# EAGLE design exciting_voltage2 (EAGLE 6.5.0)
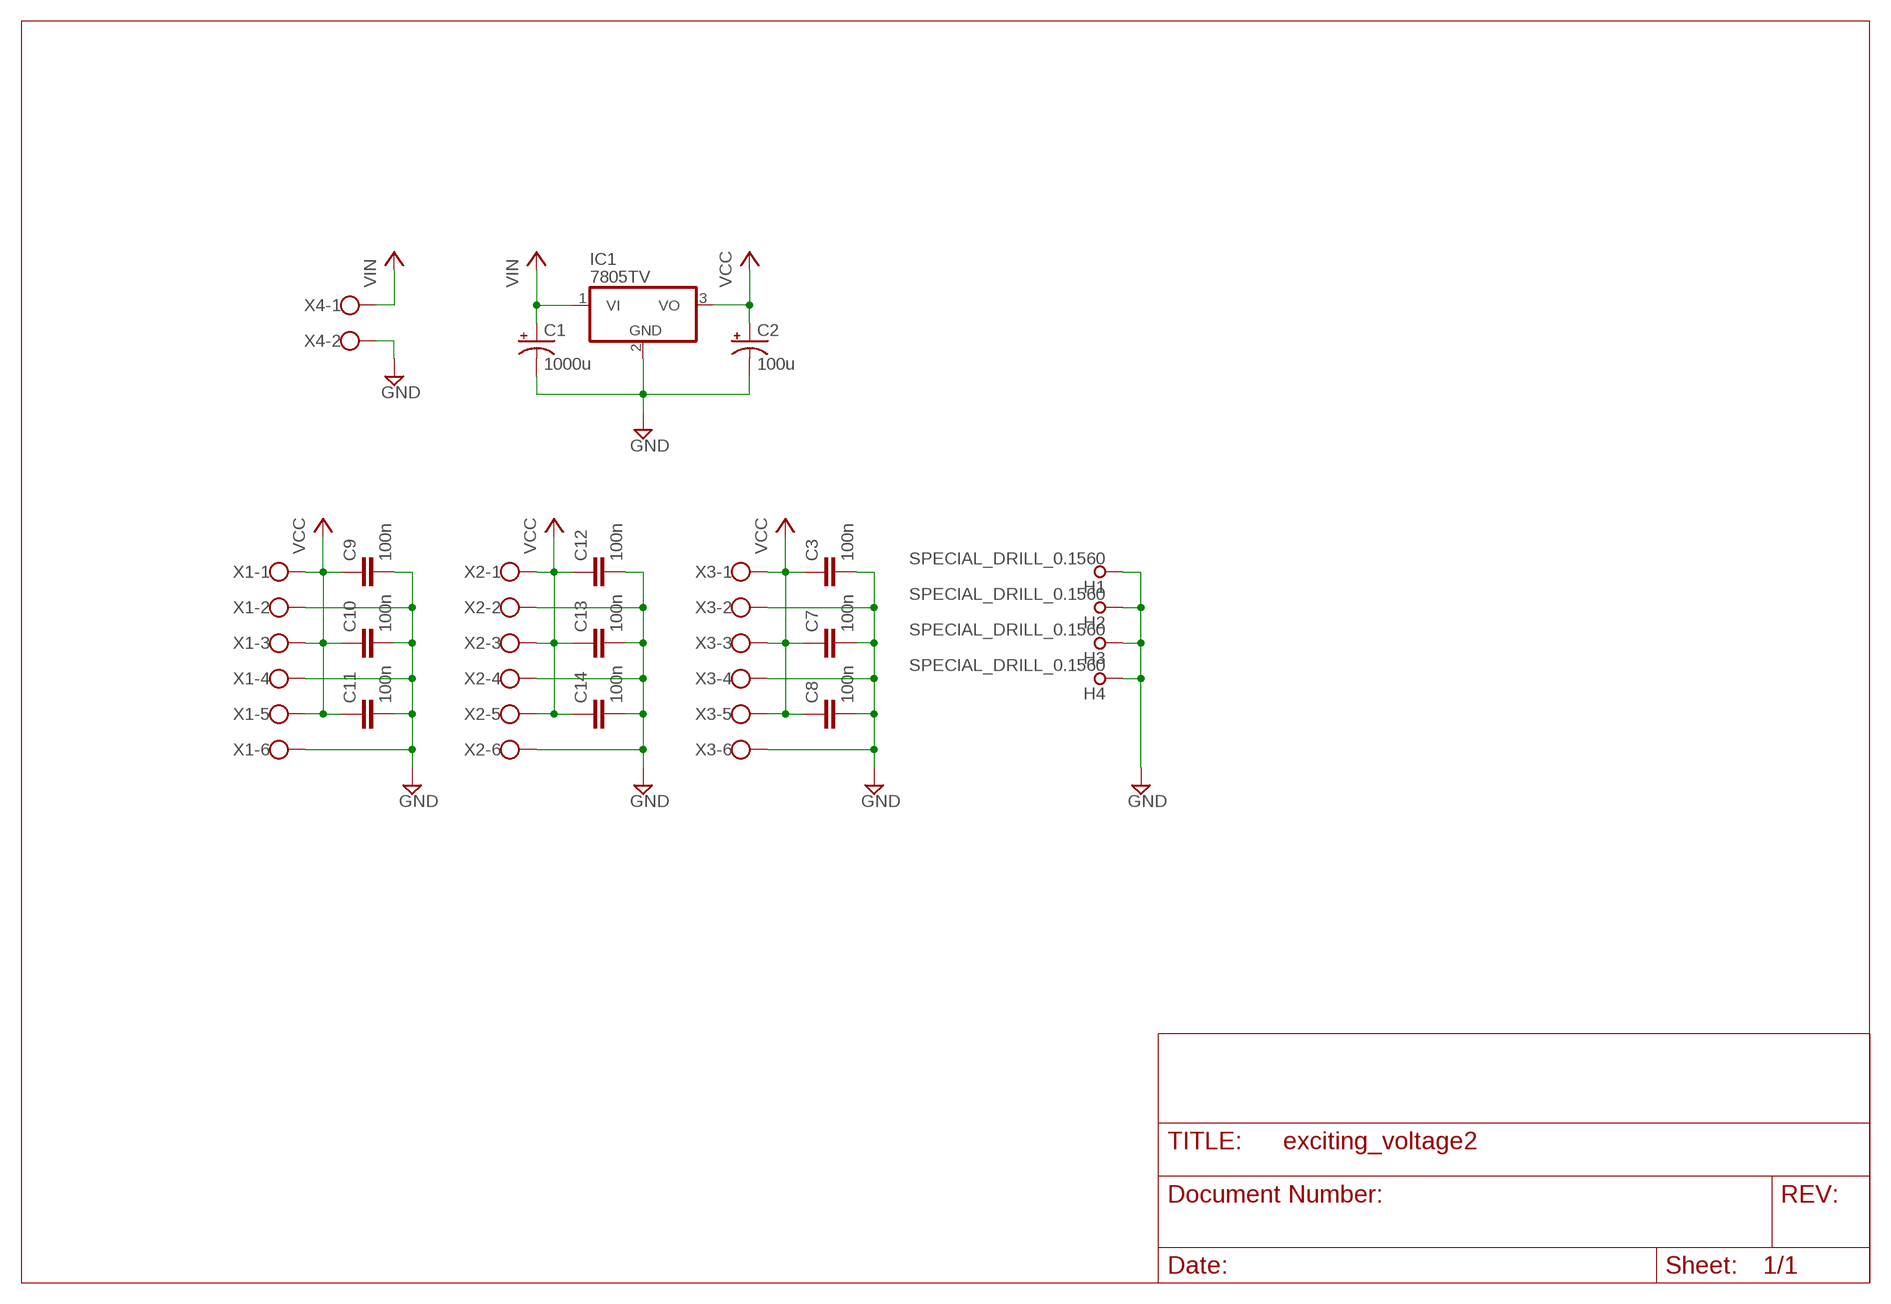
[diagram p0: schematic, sheet 1]

## Parts
C1  1000u  RCL_CPOL-USE5-13  [RCL_E5-13]
C2  100u  RCL_CPOL-USE2.5-7  [RCL_E2,5-7]
C3  100n  RCL_C-EU050-025X075  [RCL_C050-025X075]
C7  100n  RCL_C-EU050-025X075  [RCL_C050-025X075]
C8  100n  RCL_C-EU050-025X075  [RCL_C050-025X075]
C9  100n  RCL_C-EU050-025X075  [RCL_C050-025X075]
C10  100n  RCL_C-EU050-025X075  [RCL_C050-025X075]
C11  100n  RCL_C-EU050-025X075  [RCL_C050-025X075]
C12  100n  RCL_C-EU050-025X075  [RCL_C050-025X075]
C13  100n  RCL_C-EU050-025X075  [RCL_C050-025X075]
C14  100n  RCL_C-EU050-025X075  [RCL_C050-025X075]
H1  SPECIAL_DRILL_0.1560  [PAD_0.1560]
H2  SPECIAL_DRILL_0.1560  [PAD_0.1560]
H3  SPECIAL_DRILL_0.1560  [PAD_0.1560]
H4  SPECIAL_DRILL_0.1560  [PAD_0.1560]
IC1  7805TV  [TO220V]
X1  5EHDRC-6P  [5EHDRC-6P]
X2  5EHDRC-6P  [5EHDRC-6P]
X3  5EHDRC-6P  [5EHDRC-6P]
X4  5EHDRC-2P  [5EHDRC-2P]

## Nets
GND: C1.- C2.- C3.2 C7.2 C8.2 C9.2 C10.2 C11.2 C12.2 C13.2 C14.2 H1.1 H2.1 H3.1 H4.1 IC1.2(GND) X1.2 X1.4 X1.6 X2.2 X2.4 X2.6 X3.2 X3.4 X3.6 X4.2
VCC: C2.+ C3.1 C7.1 C8.1 C9.1 C10.1 C11.1 C12.1 C13.1 C14.1 IC1.3(VO) X1.1 X1.3 X1.5 X2.1 X2.3 X2.5 X3.1 X3.3 X3.5
VIN: C1.+ IC1.1(VI) X4.1

## Library data of the parts
C1 C2 = ipas:RCL_CPOL-US: POLARIZED CAPACITOR, American symbol
C3 C7-C14 = ipas:RCL_C-EU: CAPACITOR, European symbol
H1-H4 = ipas:SPECIAL_DRILL_: Special drills
IC1 = linear:78*: Positive VOLTAGE REGULATOR Source: http://cache.national.com/ds/LM/LM78L05.pdf http://www.fairchildsemi.com/ds/LM/LM7805.pdf
X1-X3 = ipas:5EHDRC-6P: Dinkle Headers(Sockets) for pluggable terminal blocks / ECH & EHD series TERMINAL BLOCK, 300V/15A
X4 = ipas:5EHDRC-2P: Dinkle Headers(Sockets) for pluggable terminal blocks / ECH & EHD series TERMINAL BLOCK, 300V/15A

## Board
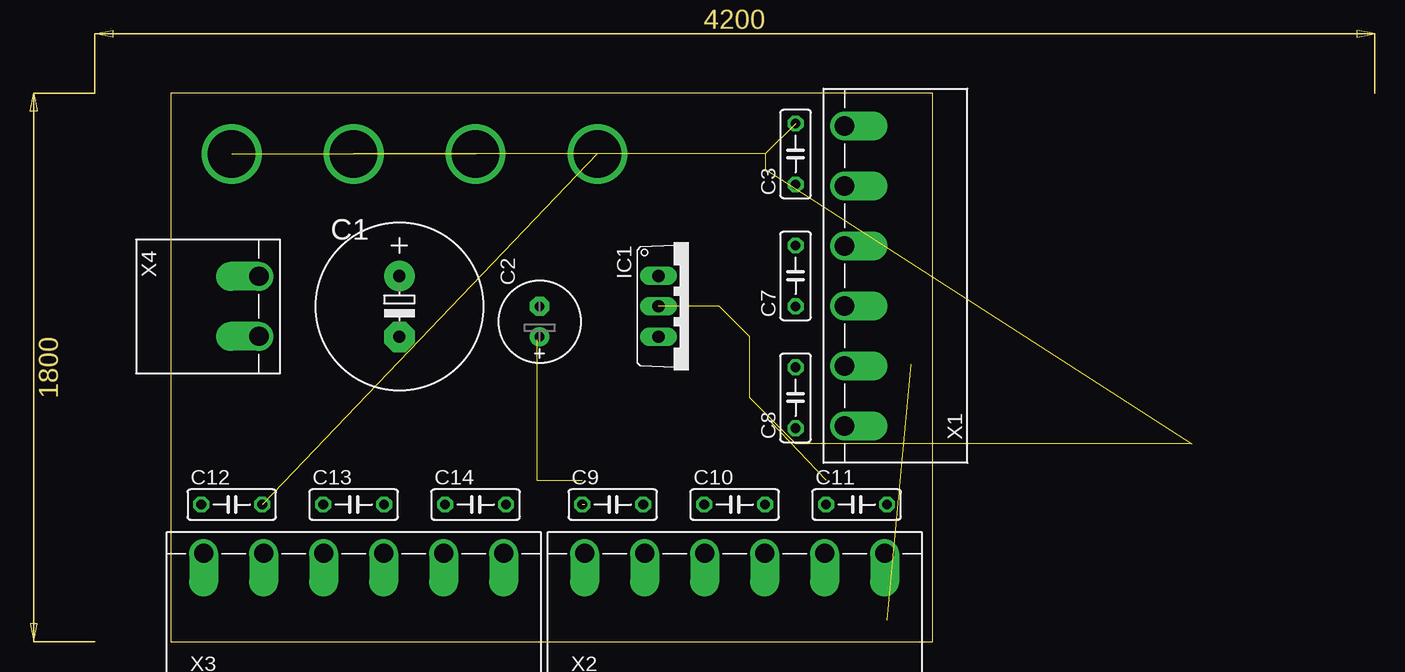
[diagram p1: board, top side]
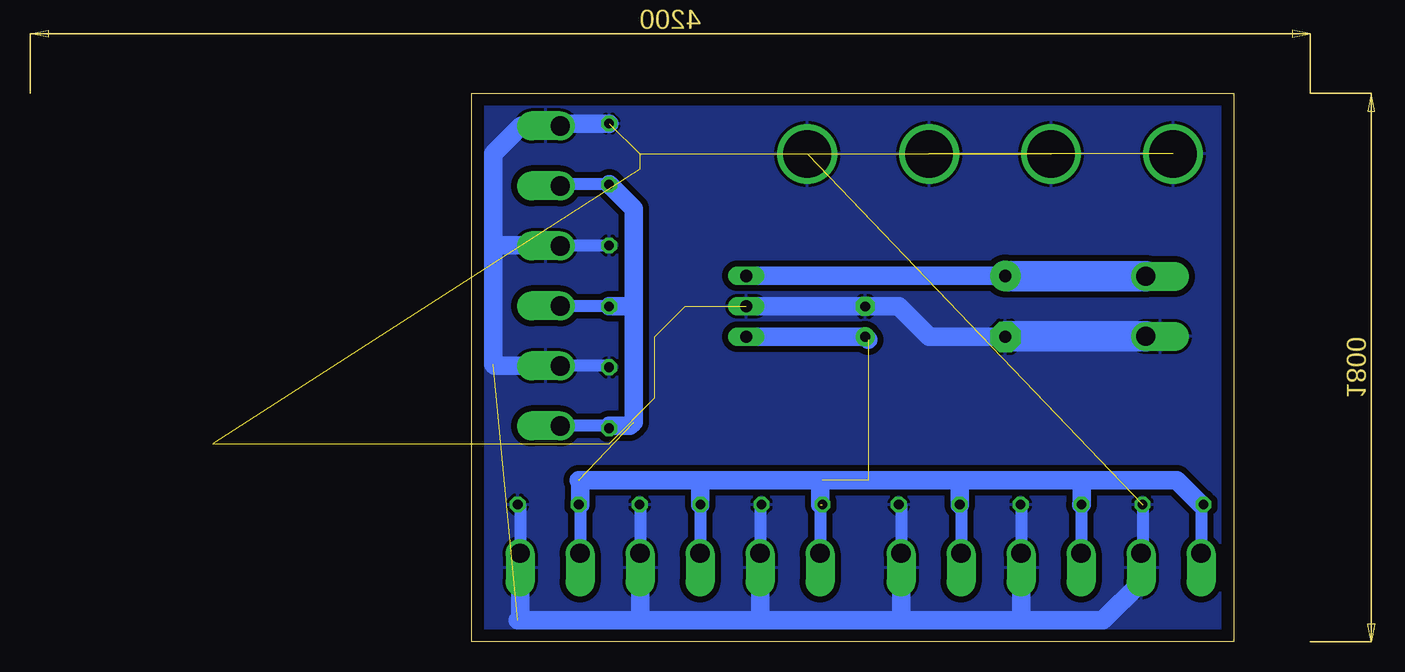
[diagram p2: board, bottom side, seen from below]

Size 63.5 x 45.72 mm. Coordinates in mm from the lower left corner, seen from the top.
Outline: 0,0 63.5,0 63.5,45.72 0,45.72 0,0
Copper layers (1*16): Top 0.035mm / dielectric 1.5mm / Bottom 0.035mm
Design rules "default": minimum track width 10mil, minimum drill 24mil, track to track 20mil, track to pad 20mil, pad to pad 20mil, via to via 20mil, smd to smd 8mil, copper to edge 40mil, drill to drill 10mil, minimum pad ring 10mil, minimum via ring 8mil, stop-mask expansion 4mil, vias tented up to drill 0mil, thermal gap 10mil

### Footprints (pad centres in the part's own frame; a part is rotated, then mirrored left to right if it is on the bottom)
RCL_E5-13 = drill 1.016 pad 2.54: + -2.54,0 | drill 1.016 pad 2.54 octagon: - 2.54,0
RCL_E2,5-7 = drill 0.813 pad 1.6: + -1.27,0 | drill 0.813 pad 1.6 octagon: - 1.27,0
RCL_C050-025X075 = drill 0.813 octagon: 1 -2.54,0; 2 2.54,0
PAD_0.1560 = drill 3.962 pad 3.962: 1 0,0
TO220V = drill 1.016 long: 1 -2.54,-2.54; 2 0,-2.54; 3 2.54,-2.54
5EHDRC-6P = drill 1.6 offset: 1 -12.5,2.28; 2 -7.5,2.28; 3 -2.5,2.28; 4 2.5,2.28; 5 7.5,2.28; 6 12.5,2.28
5EHDRC-2P = drill 1.6 offset: 1 -2.5,2.28; 2 2.5,2.28

### Placement (x,y rotation side)
C1  19.05,27.94 270 top
C2  30.73,26.67 90 top
C3  52.07,40.64 90 top
C7  52.07,30.48 90 top
C8  52.07,20.32 90 top
C9  36.83,11.43 0 top
C10  46.99,11.43 0 top
C11  57.15,11.43 0 top
C12  5.08,11.43 0 top
C13  15.24,11.43 0 top
C14  25.4,11.43 0 top
H1  35.56,40.64 0 top
H2  15.24,40.64 0 top
H3  25.4,40.64 0 top
H4  5.08,40.64 0 top
IC1  43.18,27.94 270 top
X1  58.42,30.48 90 top
X2  46.99,5.08 0 top
X3  15.24,5.08 0 top
X4  5.08,27.94 270 top

### Tracks (layer width: path | path; a pad name or v marks a point on that pad's centre or on a via)
GND  (13 unrouted)
  Bottom 1.016: 7.74,11.43 C12.2 7.62,7.48 X3.2 | C13.2 17.74,11.43 X3.4 | C14.2 27.74,11.43 X3.6 | C9.2 39.49,11.43 X2.2 | 49.49,11.43 C10.2 49.49,11.39 X2.4 | C11.2 59.49,11.43 X2.6 | C8.2 52.07,22.98 X1.2 | 56.1,33.02 X1.4 52.11,32.98 C7.2 | 55.94,43.18 X1.6
  Bottom 1.524: C1.- 25.4,25.4 27.94,27.94 C2.- IC1.2 | X3.2 7.74,4.96 10.92,1.78 17.78,1.78 | 17.78,1.78 27.94,1.78 | 27.94,1.78 39.88,1.78 | 39.88,1.78 49.78,1.78 | 49.78,1.78 59.69,1.78 59.49,1.98 X2.6 | 61.72,33.02 61.72,23.11 61.59,22.98 X1.2 | 61.72,33.02 61.72,40.64 59.38,42.98 X1.6 | X3.4 17.74,1.82 17.78,1.78 | X3.6 27.74,1.98 27.94,1.78 | X2.2 39.49,2.17 39.88,1.78 | X2.4 49.49,2.07 49.78,1.78 | 56.1,33.02 61.72,33.02 | 55.94,43.18 C3.2
  Bottom 2.54: X4.2 19.01,25.44 C1.-
  pour Bottom: 0,45.72 0,0 100.33,0 100.33,45.72
VCC  (4 unrouted)
  Bottom 1.016: C12.1 2.74,11.43 X3.1 | C13.1 12.74,11.43 X3.3 | C14.1 22.74,11.43 X3.5 | 34.49,11.43 X2.1 | C10.1 44.49,11.43 X2.3 | C11.1 54.49,11.43 X2.5 | C8.1 52.07,17.98 X1.1 | C7.1 56.1,27.94 X1.3 | C3.1 56.02,38.1 X1.5
  Bottom 1.524: IC1.3 C2.+ 30.48,25.15 | 2.74,11.43 4.77,13.46 12.7,13.46 | 12.7,13.46 22.86,13.46 | 12.74,11.43 12.7,11.47 12.7,13.46 | C14.1 22.86,13.46 | 22.86,13.46 34.29,13.46 | 34.29,13.46 44.7,13.46 | 44.7,13.46 54.61,13.46 54.49,13.34 54.49,11.43 | 50.04,27.94 50.04,18.29 50.35,17.98 52.07,17.98 | 50.04,27.94 50.04,36.07 C3.1 | 34.49,11.43 34.49,13.26 34.29,13.46 | 44.49,11.43 44.49,13.25 44.7,13.46 | C7.1 50.04,27.94
VIN
  Bottom 1.524: C1.+ IC1.1
  Bottom 2.54: X4.1 19.01,30.44 C1.+